# EAGLE design Cube4Control (EAGLE 7.3.0)
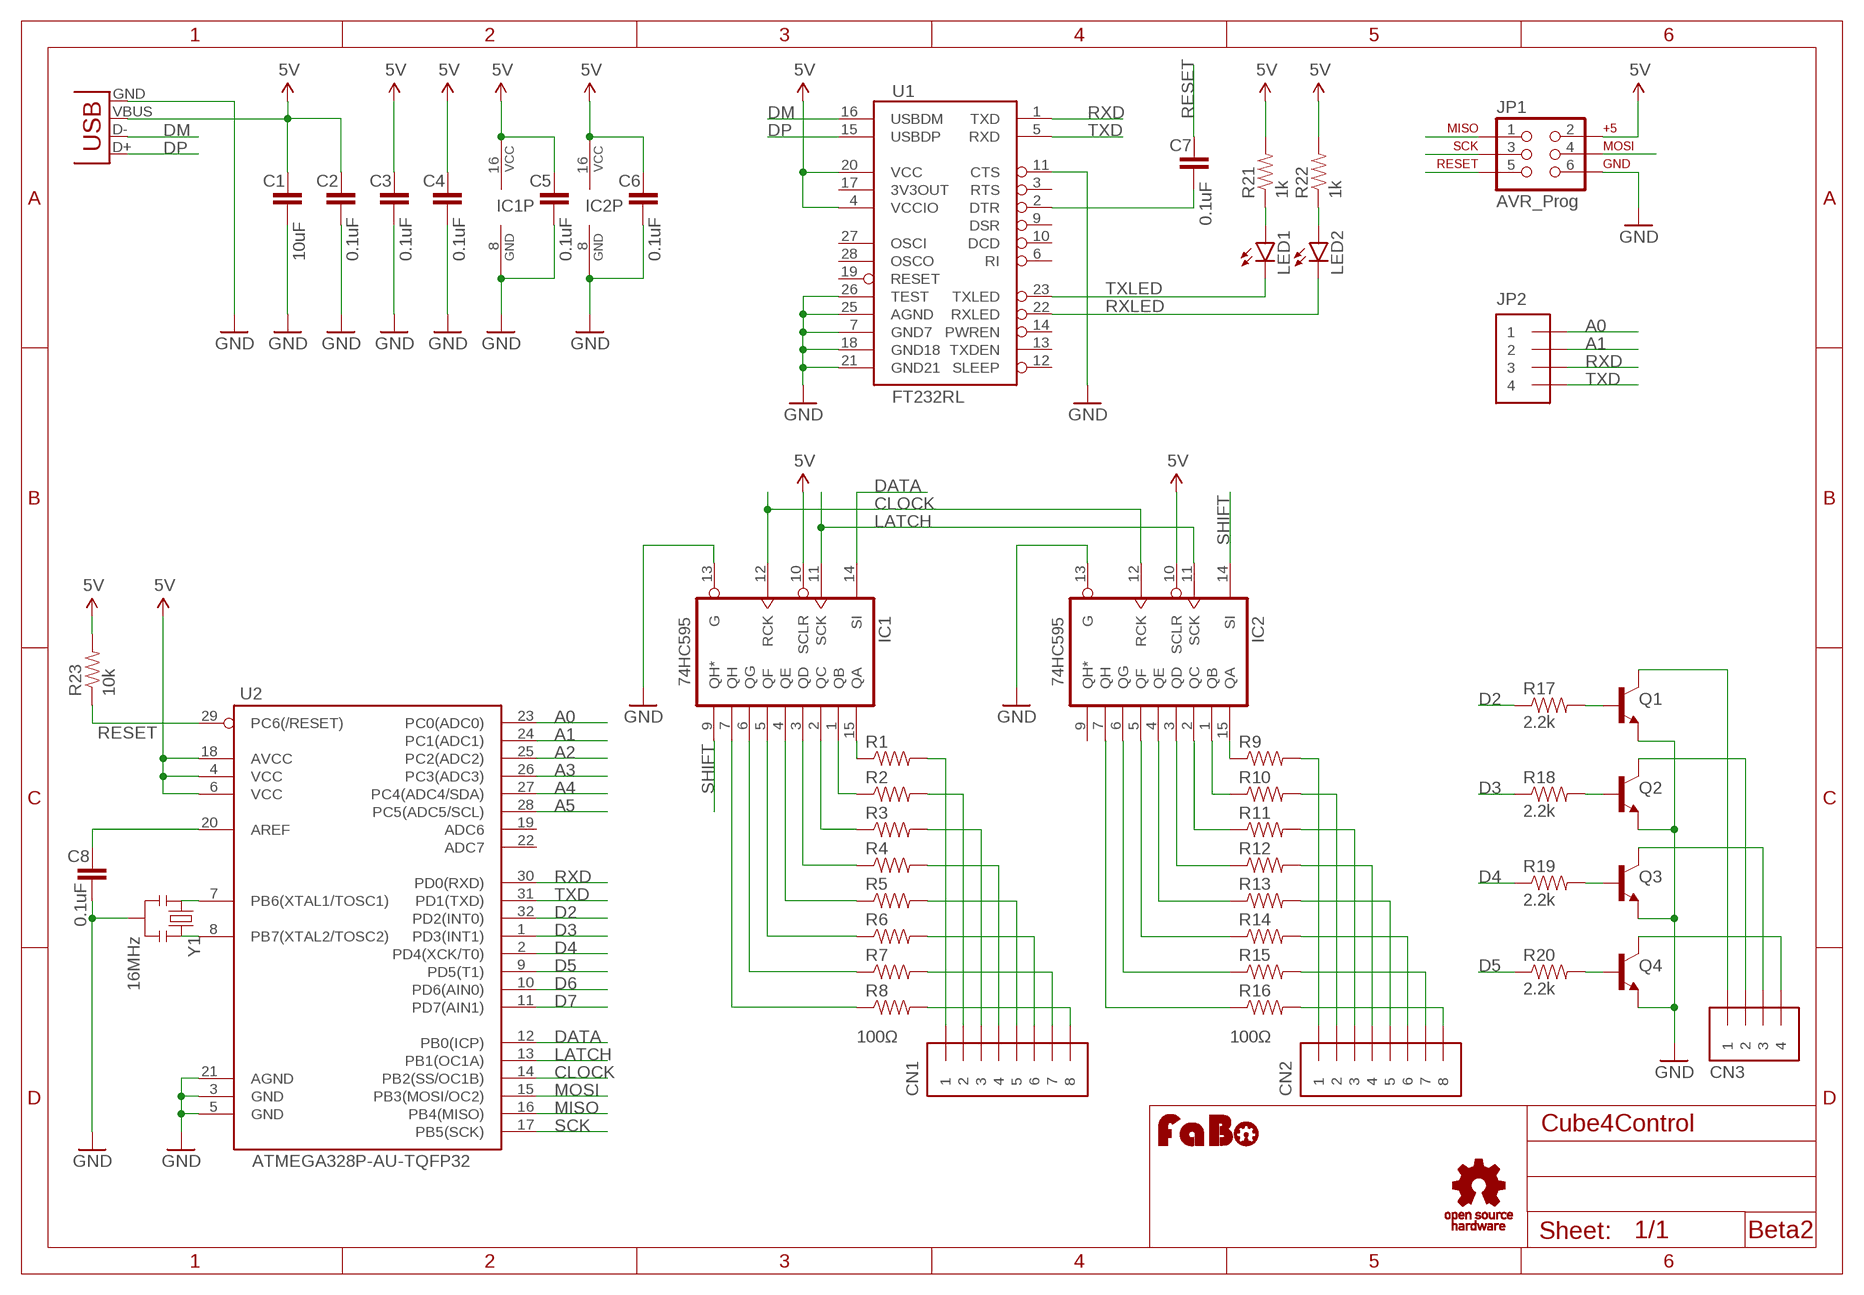
[diagram p0: schematic, sheet 1]

## Parts
C1  10uF  CAP-EIA1206  [EIA1206]
C2  0.1uF  CAP-EIA0603  [EIA0603]
C3  0.1uF  CAP-EIA0603  [EIA0603]
C4  0.1uF  CAP-EIA0603  [EIA0603]
C5  0.1uF  CAP-EIA0603  [EIA0603]
C6  0.1uF  CAP-EIA0603  [EIA0603]
C7  0.1uF  CAP-EIA0603  [EIA0603]
C8  0.1uF  CAP-EIA0603  [EIA0603]
CN1  PINHEAD-1X8  [1X8-SNEAKY]
CN2  PINHEAD-1X8  [1X8-SNEAKY]
CN3  PINHEAD-1X4  [1X4-SNEAKY]
IC1  74HC595  74HC595-SO16  [SO16-3.9]
IC2  74HC595  74HC595-SO16  [SO16-3.9]
JP1  AVR_Prog  AVR_ISP-TC  [TC2030-MCP]
JP2  PINHEAD-1X4  [1X4-SNEAKY]
LED1  LED-EIA0603  [EIA0603-LED]
LED2  LED-EIA0603  [EIA0603-LED]
Q1  NPN-2SC3325  [SOT23-3]
Q2  NPN-2SC3325  [SOT23-3]
Q3  NPN-2SC3325  [SOT23-3]
Q4  NPN-2SC3325  [SOT23-3]
R1  RES-EIA0603  [EIA0603@1]
R2  RES-EIA0603  [EIA0603@1]
R3  RES-EIA0603  [EIA0603@1]
R4  RES-EIA0603  [EIA0603@1]
R5  RES-EIA0603  [EIA0603@1]
R6  RES-EIA0603  [EIA0603@1]
R7  RES-EIA0603  [EIA0603@1]
R8  RES-EIA0603  [EIA0603@1]
R9  RES-EIA0603  [EIA0603@1]
R10  RES-EIA0603  [EIA0603@1]
R11  RES-EIA0603  [EIA0603@1]
R12  RES-EIA0603  [EIA0603@1]
R13  RES-EIA0603  [EIA0603@1]
R14  RES-EIA0603  [EIA0603@1]
R15  RES-EIA0603  [EIA0603@1]
R16  RES-EIA0603  [EIA0603@1]
R17  2.2k  RES-EIA0603  [EIA0603@1]
R18  2.2k  RES-EIA0603  [EIA0603@1]
R19  2.2k  RES-EIA0603  [EIA0603@1]
R20  2.2k  RES-EIA0603  [EIA0603@1]
R21  1k  RES-EIA0603  [EIA0603@1]
R22  1k  RES-EIA0603  [EIA0603@1]
R23  10k  RES-EIA0603  [EIA0603@1]
U1  FT232RL  [SSOP28]
U2  ATMEGA328P-AU-TQFP32  [TQFP-32-08]
U$2  LOGO_FABO-M  [LOGO_FABO_M]
U$4  LOGO_OSHW_T-M  [LOGO_OSHW_T_M]
USB1  USB-B-MICRO_SMD  [USB_B_MICRO]
Y1  16MHz  RESONATOR  [RESONATOR_SMD]

## Nets
5V: C1.1 C2.1 C3.1 C4.1 C5.1 C6.1 IC1.10(SCLR) IC1.16(VCC) IC2.10(SCLR) IC2.16(VCC) JP1.2 R21.2 R22.2 R23.2 U1.4(VCCIO) U1.20(VCC) U2.4(VCC) U2.6(VCC) U2.18(AVCC) USB1.VBUS
A0: JP2.1 U2.23(PC0(ADC0))
A1: JP2.2 U2.24(PC1(ADC1))
A2: U2.25(PC2(ADC2))
A3: U2.26(PC3(ADC3))
A4: U2.27(PC4(ADC4/SDA))
A5: U2.28(PC5(ADC5/SCL))
AREF: C8.1 U2.20(AREF)
CLOCK: IC1.12(RCK) IC2.12(RCK) U2.14(PB2(SS/OC1B))
D2: R17.1 U2.32(PD2(INT0))
D3: R18.1 U2.1(PD3(INT1))
D4: R19.1 U2.2(PD4(XCK/T0))
D5: R20.1 U2.9(PD5(T1))
D6: U2.10(PD6(AIN0))
D7: U2.11(PD7(AIN1))
DATA: IC1.14(SI) U2.12(PB0(ICP))
DM: U1.16(USBDM) USB1.D-
DP: U1.15(USBDP) USB1.D+
DTR: C7.2 U1.2(DTR)
GND: C1.2 C2.2 C3.2 C4.2 C5.2 C6.2 C8.2 IC1.8(GND) IC1.13(G) IC2.8(GND) IC2.13(G) JP1.6 Q1.2(E) Q2.2(E) Q3.2(E) Q4.2(E) U1.7(GND7) U1.11(CTS) U1.18(GND18) U1.21(GND21) U1.25(AGND) U1.26(TEST) U2.3(GND) U2.5(GND) U2.21(AGND) USB1.GND Y1.2
LATCH: IC1.11(SCK) IC2.11(SCK) U2.13(PB1(OC1A))
MISO: JP1.1 U2.16(PB4(MISO))
MOSI: JP1.4 U2.15(PB3(MOSI/OC2))
N$1: LED1.A R21.1
N$2: CN3.1 Q1.3(C)
N$3: CN3.2 Q2.3(C)
N$4: CN3.3 Q3.3(C)
N$5: U2.7(PB6(XTAL1/TOSC1)) Y1.1
N$6: U2.8(PB7(XTAL2/TOSC2)) Y1.3
N$8: CN3.4 Q4.3(C)
N$9: Q1.1(B) R17.2
N$10: Q2.1(B) R18.2
N$11: Q3.1(B) R19.2
N$12: Q4.1(B) R20.2
N$13: CN2.1 R9.2
N$14: CN2.2 R10.2
N$15: CN2.3 R11.2
N$16: CN2.4 R12.2
N$17: CN2.5 R13.2
N$18: CN2.6 R14.2
N$19: CN2.7 R15.2
N$20: CN2.8 R16.2
N$21: IC2.15(QA) R9.1
N$22: IC2.1(QB) R10.1
N$23: IC2.2(QC) R11.1
N$24: IC2.3(QD) R12.1
N$25: IC2.4(QE) R13.1
N$26: IC2.5(QF) R14.1
N$27: IC2.6(QG) R15.1
N$28: IC1.15(QA) R1.1
N$29: IC1.1(QB) R2.1
N$30: LED2.A R22.1
N$31: IC1.2(QC) R3.1
N$32: IC1.3(QD) R4.1
N$33: IC2.7(QH) R16.1
N$34: IC1.4(QE) R5.1
N$35: IC1.5(QF) R6.1
N$36: IC1.6(QG) R7.1
N$37: IC1.7(QH) R8.1
N$38: CN1.1 R1.2
N$39: CN1.2 R2.2
N$40: CN1.3 R3.2
N$41: CN1.4 R4.2
N$42: CN1.5 R5.2
N$43: CN1.6 R6.2
N$44: CN1.7 R7.2
N$45: CN1.8 R8.2
RESET: C7.1 JP1.5 R23.1 U2.29(PC6(/RESET))
RXD: JP2.3 U1.1(TXD) U2.30(PD0(RXD))
RXLED: LED2.C U1.22(RXLED)
SCK: JP1.3 U2.17(PB5(SCK))
SHIFT: IC1.9(QH*) IC2.14(SI)
TXD: JP2.4 U1.5(RXD) U2.31(PD1(TXD))
TXLED: LED1.C U1.23(TXLED)
Unconnected: IC2.9(QH*) U1.3(RTS) U1.6(RI) U1.9(DSR) U1.10(DCD) U1.12(SLEEP) U1.13(TXDEN) U1.14(PWREN) U1.17(3V3OUT) U1.19(RESET) U1.27(OSCI) U1.28(OSCO) U2.19(ADC6) U2.22(ADC7)

## Notes on the sheet
- 100Ω | 100Ω
- Beta2

## Library data of the parts
C1-C8 = Gclue:CAP: Capacitor Standard 0603 ceramic capacitor
CN1 CN2 = Gclue:PINHEAD-1X8
CN3 JP2 = Gclue:PINHEAD-1X4
IC1 IC2 = Gclue:74HC595
JP1 = Gclue:AVR_ISP
LED1 LED2 = Gclue:LED: LED
Q1-Q4 = Gclue:NPN
R1-R23 = Gclue:RES
U1 = Gclue:FT232RL: FT232RL FTDI FT232RL USB to serial UART interface SSOP28
U2 = Gclue:ATMEGA328P-AU: ATmega328p-AU
U$2 = FaBo:LOGO_FABO
U$4 = Gclue:LOGO_OSHW_T
USB1 = Gclue:USB: USB Female
Y1 = Gclue:RESONATOR: RESONATOR CSTCE16M0V53

## Net classes
0 default: width 0.254 mm

## Board
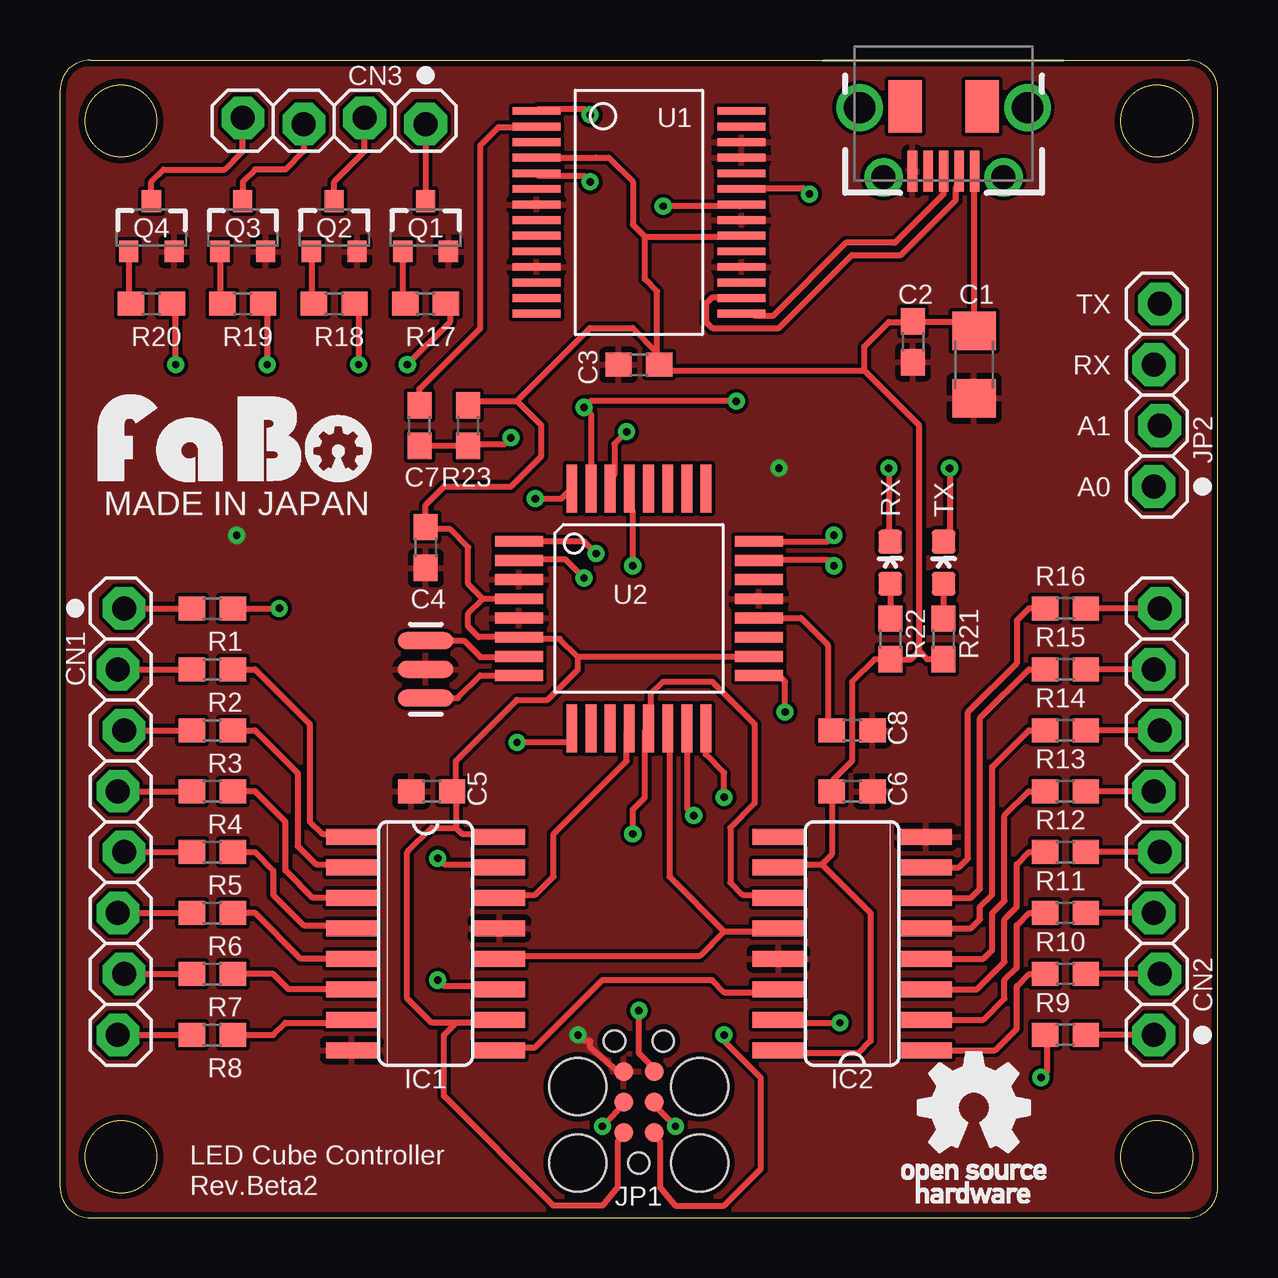
[diagram p1: board, top side]
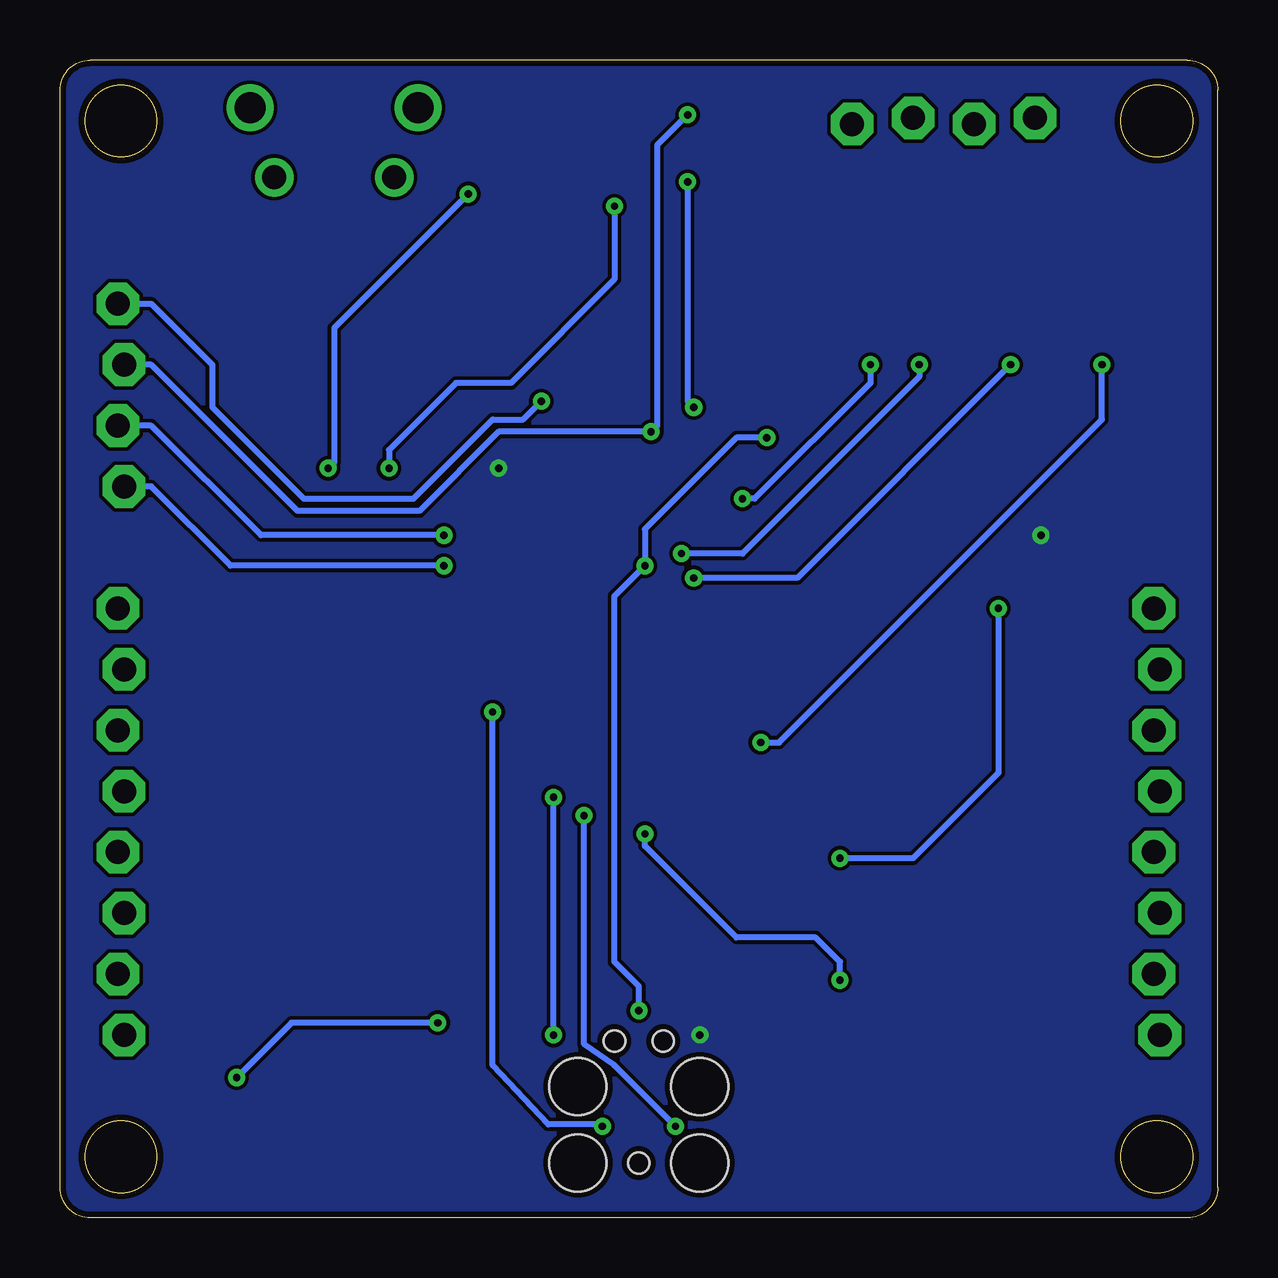
[diagram p2: board, bottom side, seen from below]

Size 48.26 x 48.26 mm. Coordinates in mm from the lower left corner, seen from the top.
Outline: 48.26,1.27 48.26,46.99 arc90 46.99,48.26 1.27,48.26 arc90 0,46.99 0,1.27 arc90 1.27,0 46.99,0 arc90 48.26,1.27
Outline: circle at 2.54,2.54 radius 1.5
Outline: circle at 45.72,2.54 radius 1.5
Outline: circle at 45.72,45.72 radius 1.5
Outline: circle at 2.54,45.72 radius 1.5
Copper layers (1*16): Top 0.035mm / dielectric 1.5mm / Bottom 0.035mm
Design rules "DFRobot_Eagle_Rule_v0.4": minimum track width 6mil, minimum drill 12mil, track to track 6mil, track to pad 6mil, pad to pad 6mil, via to via 6mil, smd to smd 0mil, copper to edge 10mil, drill to drill 10mil, minimum pad ring 12mil, minimum via ring 8mil, stop-mask expansion 2mil, vias tented up to drill 25mil, thermal gap 10mil

### Footprints (pad centres in the part's own frame; a part is rotated, then mirrored left to right if it is on the bottom)
EIA1206 = smd 1.6 x 1.8: 1 -1.4,0; 2 1.4,0
EIA0603 = smd 1.1 x 1: 1 -0.85,0; 2 0.85,0
1X8-SNEAKY = drill 1 pad 1.778 octagon: 1 -8.89,0.127; 2 -6.35,-0.127; 3 -3.81,0.127; 4 -1.27,-0.127; 5 1.27,0.127; 6 3.81,-0.127; 7 6.35,0.127; 8 8.89,-0.127
1X4-SNEAKY = drill 1 pad 1.778 octagon: 1 -3.81,0.127; 2 -1.27,-0.127; 3 1.27,0.127; 4 3.81,-0.127
SO16-3.9 = smd 0.66 x 2.159: 1 -4.445,-3.073; 2 -3.175,-3.073; 3 -1.905,-3.073; 4 -0.635,-3.073; 5 0.635,-3.073; 6 1.905,-3.073; 7 3.175,-3.073; 8 4.445,-3.073; 9 4.445,3.073; 10 3.175,3.073; 11 1.905,3.073; 12 0.635,3.073; 13 -0.635,3.073; 14 -1.905,3.073; 15 -3.175,3.073; 16 -4.445,3.073
TC2030-MCP = smd 0.787 x 0.787: 1 -1.27,-0.635; 2 -1.27,0.635; 3 0,-0.635; 4 0,0.635; 5 1.27,-0.635; 6 1.27,0.635 | hole 0.889: -2.54,0; 2.54,-1.016; 2.54,1.016 | hole 2.375: -2.54,2.54; -2.54,-2.54; 0.635,-2.54; 0.635,2.54
EIA0603-LED = smd 1 x 1: A 0,-0.877; C 0,0.877
SOT23-3 = smd 0.8 x 0.9: 1 -0.95,-1; 2 0.95,-1; 3 0,1.1
EIA0603@1 = smd 1.1 x 1: 1 -0.85,0; 2 0.85,0
SSOP28 = smd 0.325 x 2: 1 -4.225,-4.275; 2 -3.575,-4.275; 3 -2.925,-4.275; 4 -2.275,-4.275; 5 -1.625,-4.275; 6 -0.975,-4.275; 7 -0.325,-4.275; 8 0.325,-4.275; 9 0.975,-4.275; 10 1.625,-4.275; 11 2.275,-4.275; 12 2.925,-4.275; 13 3.575,-4.275; 14 4.225,-4.275; 15 4.225,4.275; 16 3.575,4.275; 17 2.925,4.275; 18 2.275,4.275; 19 1.625,4.275; 20 0.975,4.275; 21 0.325,4.275; 22 -0.325,4.275; 23 -0.975,4.275; 24 -1.625,4.275; 25 -2.275,4.275; 26 -2.925,4.275; 27 -3.575,4.275; 28 -4.225,4.275
TQFP-32-08 = smd 2 x 0.45: 1 -5,2.8; 2 -5,2; 3 -5,1.2; 4 -5,0.4; 5 -5,-0.4; 6 -5,-1.2; 7 -5,-2; 8 -5,-2.8; 17 5,-2.8; 18 5,-2; 19 5,-1.2; 20 5,-0.4; 21 5,0.4; 22 5,1.2; 23 5,2; 24 5,2.8 | smd 0.45 x 2: 9 -2.8,-5; 10 -2,-5; 11 -1.2,-5; 12 -0.4,-5; 13 0.4,-5; 14 1.2,-5; 15 2,-5; 16 2.8,-5; 25 2.8,5; 26 2,5; 27 1.2,5; 28 0.4,5; 29 -0.4,5; 30 -1.2,5; 31 -2,5; 32 -2.8,5
USB_B_MICRO = smd 1.7 x 0.4: D+ 2.1,0; D- 2.1,0.65; GND 2.1,-1.3; ID 2.1,-0.65; VBUS 2.1,1.3 | drill 1 pad 1.4: P$1 2.35,2.5; P$2 2.35,-2.5 | drill 1.3 pad 1.7: P$3 -0.55,3.5; P$4 -0.55,-3.5 | smd 2.2 x 1.4: P$6 -0.6,1.6; P$7 -0.6,-1.6
RESONATOR_SMD = smd 0.7 x 2.3: 1 -1.2,0; 2 0,0; 3 1.2,0

### Placement (x,y rotation side)
C1  38.1,35.56 270 top
C2  35.56,36.51 270 top
C3  24.13,35.56 180 top
C4  15.24,27.94 270 top
C5  15.49,17.78 180 top
C6  33.02,17.78 0 top
C7  14.99,33.02 90 top
C8  33.02,20.32 0 top
CN1  2.54,16.51 270 top
CN2  45.72,16.51 90 top
CN3  11.43,45.72 180 top
IC1  15.24,11.43 270 top
IC2  33.02,11.43 90 top
JP1  24.13,4.83 90 top
JP2  45.72,34.29 90 top
LED1  36.83,27.3 0 top
LED2  34.61,27.3 0 top
Q1  15.24,41.27 0 top
Q2  11.43,41.27 0 top
Q3  7.62,41.27 0 top
Q4  3.81,41.27 0 top
R1  6.35,25.4 180 top
R2  6.35,22.86 180 top
R3  6.35,20.32 180 top
R4  6.35,17.78 180 top
R5  6.35,15.24 180 top
R6  6.35,12.7 180 top
R7  6.35,10.16 180 top
R8  6.35,7.62 180 top
R9  41.91,7.62 0 top
R10  41.91,10.16 0 top
R11  41.91,12.7 0 top
R12  41.91,15.24 0 top
R13  41.91,17.78 0 top
R14  41.91,20.32 0 top
R15  41.91,22.86 0 top
R16  41.91,25.4 0 top
R17  15.24,38.1 180 top
R18  11.43,38.1 180 top
R19  7.62,38.1 180 top
R20  3.81,38.1 180 top
R21  36.83,24.13 270 top
R22  34.61,24.13 270 top
R23  17.02,33.02 90 top
U1  24.13,41.91 270 top
U2  24.13,25.4 0 top
U$2  7.3,30.67 0 top
U$4  38.1,4.57 0 top
USB1  36.83,45.72 270 top
Y1  15.24,22.86 270 top

### Tracks (layer width: path | path; a pad name or v marks a point on that pad's centre or on a via)
5V
  Top 0.254: USB1.VBUS 38.1,43.62 C1.1 37.7,37.36 C2.1 35.31,37.34 34.54,37.34 33.53,36.32 33.53,35.31 | 28.45,40.89 U1.20 28.36,40.89 24.38,40.89 | U1.4 20.08,44.19 22.35,44.2 22.86,44.2 23.88,43.18 23.88,41.4 24.38,40.89 | R23.2 17.27,34.04 19.05,34.04 | 19.05,34.04 22.1,37.08 23.88,37.08 24.89,36.07 | 24.89,36.07 24.89,35.56 C3.1 25.15,35.31 33.53,35.31 | 24.89,36.07 24.89,38.61 24.38,39.12 24.38,40.89 | 19.05,34.04 20.07,33.02 20.07,31.75 18.8,30.48 16,30.48 15.24,29.72 C4.1 15.33,28.7 16.26,28.7 17.02,27.94 17.02,26.42 17.63,25.8 | R21.2 36.16,23.28 35.81,23.62 | 35.81,23.62 35.81,33.02 33.53,35.31 | 35.81,23.62 35.47,23.28 R22.2 33.95,23.28 33.02,22.35 33.02,19.05 32.26,18.29 32.26,17.87 C6.1 32.17,15.15 31.75,14.73 | U2.18 28.96,23.37 21.59,23.37 | U2.4 17.63,25.8 | 17.63,25.8 17.02,25.18 17.02,24.64 17.46,24.2 U2.6 19.2,24.13 20.83,24.13 21.59,23.37 | 30.23,14.73 30.07,14.73 IC2.10 30.23,14.73 | 16.51,16.26 16.51,17.53 C5.1 16.34,17.87 16.51,18.03 16.51,19.05 19.05,21.59 20.32,21.59 21.59,22.86 21.59,23.37 | 16.51,16.26 16.76,16 18.03,16 IC1.16 | 30.23,14.73 31.75,14.73 | 31.75,14.73 33.78,12.7 33.78,7.37 33.27,6.86 30.23,6.86 IC2.16 | IC1.10 18.03,8.13 16.51,8.13 | 16.51,8.13 16,7.62 16,5.08 20.57,0.51 22.61,0.51 23.24,1.27 23.24,3.17 23.37,3.3 JP1.2 | 16.51,8.13 15.49,8.13 14.48,9.14 14.48,15.24 15.49,16.26 16.51,16.26
A0  (via drill 0.3)
  Top 0.254: U2.23 29.16,27.43 32,27.43 v32.26,27.18
  Bottom 0.254: v32.26,27.18 41.15,27.18 44.45,30.48 JP2.1
A1  (via drill 0.3)
  Top 0.254: U2.24 32,28.19 v32.26,28.45
  Bottom 0.254: v32.26,28.45 39.88,28.45 44.45,33.02 JP2.2
AREF
  Top 0.254: U2.20 30.88,25 32,23.88 32,20.49 C8.1
CLOCK
  Top 0.254: IC1.12 18.41,10.79 18.54,10.92 26.67,10.92 27.69,11.94 | 27.69,11.94 29.82,11.94 IC2.12 | U2.14 25.33,19.88 25.4,19.81 25.4,14.22 27.69,11.94
D2  (via drill 0.3)
  Top 0.254: R17.1 16.09,38.01 16.26,37.85 16.26,37.34 v14.48,35.56 | v19.81,29.97 20.9,29.97 U2.32
  Bottom 0.254: v14.48,35.56 14.48,34.8 19.3,29.97 v19.81,29.97
D3  (via drill 0.3)
  Top 0.254: R18.1 12.28,38.01 12.45,37.85 v12.45,35.56 | v22.35,27.69 21.84,28.19 U2.1
  Bottom 0.254: v12.45,35.56 12.45,35.05 19.81,27.69 v22.35,27.69
D4  (via drill 0.3)
  Top 0.254: R19.1 8.47,38.01 8.64,37.85 v8.64,35.56 | v21.84,26.67 21.08,27.43 19.16,27.43 U2.2
  Bottom 0.254: v8.64,35.56 17.53,26.67 v21.84,26.67
D5  (via drill 0.3)
  Top 0.254: U2.9 21.34,19.81 v19.05,19.81 | v4.83,35.56 4.83,37.59 4.66,37.76 R20.1
  Bottom 0.254: v19.05,19.81 18.29,19.81 4.83,33.27 v4.83,35.56
DATA
  Top 0.254: IC1.14 18.92,13.34 19.05,13.46 19.81,13.46 20.57,14.22 20.57,16 23.62,19.05 23.62,20.29 U2.12
DM
  Top 0.254: U1.16 28.39,38.35 27.18,38.35 26.92,38.1 26.92,37.34 27.18,37.08 29.97,37.08 33.02,40.13 35.05,40.13 37.34,42.42 37.34,42.93 37.48,43.04 USB1.D-
DP
  Top 0.254: USB1.D+ 36.83,42.67 34.8,40.64 32.77,40.64 29.72,37.59 28.96,37.59 28.86,37.69 U1.15
DTR
  Top 0.254: C7.2 14.99,34.54 17.53,37.08 17.53,44.7 18.29,45.47 19.84,45.47 U1.2
GND  (via drill 0.3)
  Top 0.254: JP1.6 23.24,6.1 22.1,7.11 22.1,7.37 21.84,7.37 v21.59,7.62
  other vias: 29.97,31.24 7.37,28.45
  pour Top: -1.02,49.28 49.28,49.28 49.28,-1.02 -0.76,-1.02 -1.02,-1.02
  pour Bottom: -1.02,49.28 49.28,49.28 49.28,-1.02 -0.76,-1.02 -1.02,-1.02
LATCH  (via drill 0.3)
  Top 0.254: 18.03,9.65 IC1.11 18.16,9.53 18.03,9.65 | IC2.11 29.82,13.46 28.45,13.46 27.94,13.97 27.94,16.26 28.96,17.27 28.96,20.57 27.18,22.35 25.15,22.35 24.64,21.84 24.64,20.57 24.53,20.47 U2.13 24.38,20.25 24.38,17.53 23.88,17.02 v23.88,16 | 18.03,9.65 16,9.65 v15.75,9.91
  Bottom 0.254: v15.75,9.91 15.75,10.67 16.76,11.68 20.07,11.68 23.88,15.49 v23.88,16
MISO  (via drill 0.3)
  Top 0.254: JP1.1 24.89,3.3 25.02,3.17 25.02,1.27 25.65,0.51 27.69,0.51 29.21,2.03 29.21,5.84 27.69,7.37 v27.69,7.62 | v27.69,17.53 27.69,18.54 26.92,19.3 U2.16
  Bottom 0.254: v27.69,7.62 v27.69,17.53
MOSI  (via drill 0.3)
  Top 0.254: JP1.4 23.62,4.83 v22.61,3.81 | v26.42,16.76 26.16,17.02 26.16,20.37 U2.15
  Bottom 0.254: v22.61,3.81 25.15,6.35 26.42,7.24 v26.42,16.76
N$1
  Top 0.254: LED1.A R21.1
N$2
  Top 0.254: CN3.1 Q1.3
N$3
  Top 0.254: Q2.3 11.43,43.18 12.7,44.45 CN3.2
N$4
  Top 0.254: CN3.3 10.16,44.45 9.4,43.69 8.13,43.69 7.62,43.18 Q3.3
N$5
  Top 0.254: Y1.1 16.83,24.06 17.53,23.37 19.1,23.37 U2.7
N$6
  Top 0.254: Y1.3 16.58,21.66 17.53,22.61 U2.8
N$8
  Top 0.254: Q4.3 3.81,43.18 4.32,43.69 6.86,43.69 7.62,44.45 CN3.4
N$9
  Top 0.254: Q1.1 14.29,38.2 R17.2
N$10
  Top 0.254: Q2.1 10.48,38.2 R18.2
N$11
  Top 0.254: Q3.1 6.67,38.2 R19.2
N$12
  Top 0.254: Q4.1 2.86,38.2 R20.2
N$13
  Top 0.254: CN2.1 R9.2
N$14
  Top 0.254: CN2.2 R10.2
N$15
  Top 0.254: CN2.3 R11.2
N$16
  Top 0.254: CN2.4 R12.2
N$17
  Top 0.254: CN2.5 R13.2
N$18
  Top 0.254: CN2.6 R14.2
N$19
  Top 0.254: CN2.7 R15.2
N$20
  Top 0.254: CN2.8 R16.2
N$21  (via drill 0.3)
  Top 0.254: IC2.15 30.1,8.26 30.23,8.13 v32.51,8.13 | v40.89,5.84 41.15,6.1 41.15,7.37 R9.1
  Bottom 0.254: v32.51,8.13 38.61,8.13 v40.89,5.84
N$22
  Top 0.254: IC2.1 38.99,6.99 39.88,7.87 39.88,9.65 40.39,10.16 R10.1
N$23
  Top 0.254: IC2.2 38.48,8.26 39.37,9.14 39.37,9.91 39.88,10.41 39.88,12.19 40.39,12.7 R11.1
N$24
  Top 0.254: IC2.3 38.23,9.53 39.37,10.67 39.37,12.45 39.88,12.95 39.88,14.73 40.39,15.24 R12.1
N$25
  Top 0.254: IC2.4 38.48,10.79 38.86,11.18 38.86,12.7 39.37,13.21 39.37,16.76 40.39,17.78 R13.1
N$26
  Top 0.254: IC2.5 37.97,12.06 38.35,12.45 38.35,12.95 38.86,13.46 38.86,18.8 40.39,20.32 R14.1
N$27
  Top 0.254: IC2.6 37.97,13.34 38.35,13.72 38.35,20.83 40.39,22.86 R15.1
N$28  (via drill 0.3)
  Top 0.254: R1.1 v9.14,25.4 | v15.75,14.99 16,14.73 18.03,14.73 IC1.15
  Bottom 0.254: v9.14,25.4 9.14,18.54 12.7,14.99 v15.75,14.99
N$29
  Top 0.254: R2.1 8.13,22.86 10.41,20.57 10.41,16.51 10.92,16 12.04,16 IC1.1
N$30
  Top 0.254: LED2.A R22.1
N$31
  Top 0.254: R3.1 8.13,20.32 9.91,18.54 9.91,15.49 10.67,14.73 12.04,14.73 IC1.2
N$32
  Top 0.254: IC1.3 10.54,13.34 9.4,14.48 9.4,16.51 8.13,17.78 R4.1
N$33
  Top 0.254: R16.1 40.39,25.4 39.88,24.89 39.88,23.11 37.85,21.08 37.85,14.99 37.47,14.61 IC2.7
N$34
  Top 0.254: R5.1 8.13,15.24 8.89,14.48 8.89,13.46 10.16,12.19 12.04,12.19 IC1.4
N$35
  Top 0.254: IC1.5 10.03,10.79 8.13,12.7 R6.1
N$36
  Top 0.254: IC1.6 9.53,9.53 8.89,10.16 R7.1
N$37
  Top 0.254: R8.1 8.89,7.62 9.4,8.13 12.04,8.13 IC1.7
N$38
  Top 0.254: CN1.1 R1.2
N$39
  Top 0.254: CN1.2 R2.2
N$40
  Top 0.254: CN1.3 R3.2
N$41
  Top 0.254: CN1.4 R4.2
N$42
  Top 0.254: CN1.5 R5.2
N$43
  Top 0.254: CN1.6 R6.2
N$44
  Top 0.254: CN1.7 R7.2
N$45
  Top 0.254: CN1.8 R8.2
RESET  (via drill 0.3)
  Top 0.254: C7.1 R23.1 17.27,32.26 18.54,32.26 v18.8,32.51 | v23.88,27.18 23.88,29.46 23.73,29.61 U2.29 | JP1.5 24.77,6.22 24.13,6.86 v24.13,8.64
  Bottom 0.254: v18.8,32.51 20.07,32.51 23.88,28.7 v23.88,27.18 25.15,25.91 25.15,10.67 24.13,9.65 v24.13,8.64
RXD  (via drill 0.3)
  Top 0.254: U1.1 19.95,46.23 21.84,46.23 v22.1,45.97 | v23.62,32.77 23.11,32.26 23.11,30.99 22.93,30.8 U2.30
  Bottom 0.254: v22.1,45.97 23.37,44.7 23.37,33.02 v23.62,32.77 29.97,32.77 33.27,29.46 38.35,29.46 44.45,35.56 JP2.3
RXLED  (via drill 0.3)
  Top 0.254: U1.22 28.33,42.16 v25.15,42.16 | v34.54,31.24 34.54,28.7 34.61,28.64 LED2.C
  Bottom 0.254: v25.15,42.16 25.15,39.12 29.46,34.8 31.75,34.8 34.54,32 v34.54,31.24
SCK  (via drill 0.3)
  Top 0.254: JP1.3 24.77,4.7 v25.65,3.81 | v30.23,21.08 30.23,22.35 29.98,22.6 U2.17
  Bottom 0.254: v25.65,3.81 25.83,3.89 27.91,3.89 30.23,6.35 v30.23,21.08
SHIFT
  Top 0.254: IC1.9 18.92,6.99 19.05,7.11 19.81,7.11 22.61,9.91 27.18,9.91 27.69,9.4 29.82,9.4 IC2.14
TXD  (via drill 0.3)
  Top 0.254: U1.5 19.96,43.43 21.84,43.43 v22.1,43.18 | U2.31 22.13,33.5 v21.84,33.78 22.1,34.04 v28.19,34.04
  Bottom 0.254: v22.1,43.18 22.1,34.04 v21.84,33.78 | JP2.4 44.45,38.1 41.91,35.56 41.91,33.78 38.1,29.97 33.53,29.97 30.23,33.27 28.96,33.27 v28.19,34.04
TXLED  (via drill 0.3)
  Top 0.254: U1.23 28.45,42.93 30.99,42.93 v31.24,42.67 | v37.08,31.24 37.08,28.7 36.83,28.45 LED1.C
  Bottom 0.254: v31.24,42.67 36.83,37.08 36.83,31.5 v37.08,31.24

### Text on the board
tPlace: TX | RX | A1 | MADE IN JAPAN | A0 | RX | TX | LED Cube Controller | Rev.Beta2